# EasyEDA schematic 1-Schematic_MS20_Schmitz_REPAIR.json
TITLE: Sheet_1; REV: 1.0; Date: 2025-03-28; Sheet: 1/1; Drawn By: t.friedrich-soehner; Company: Your Company
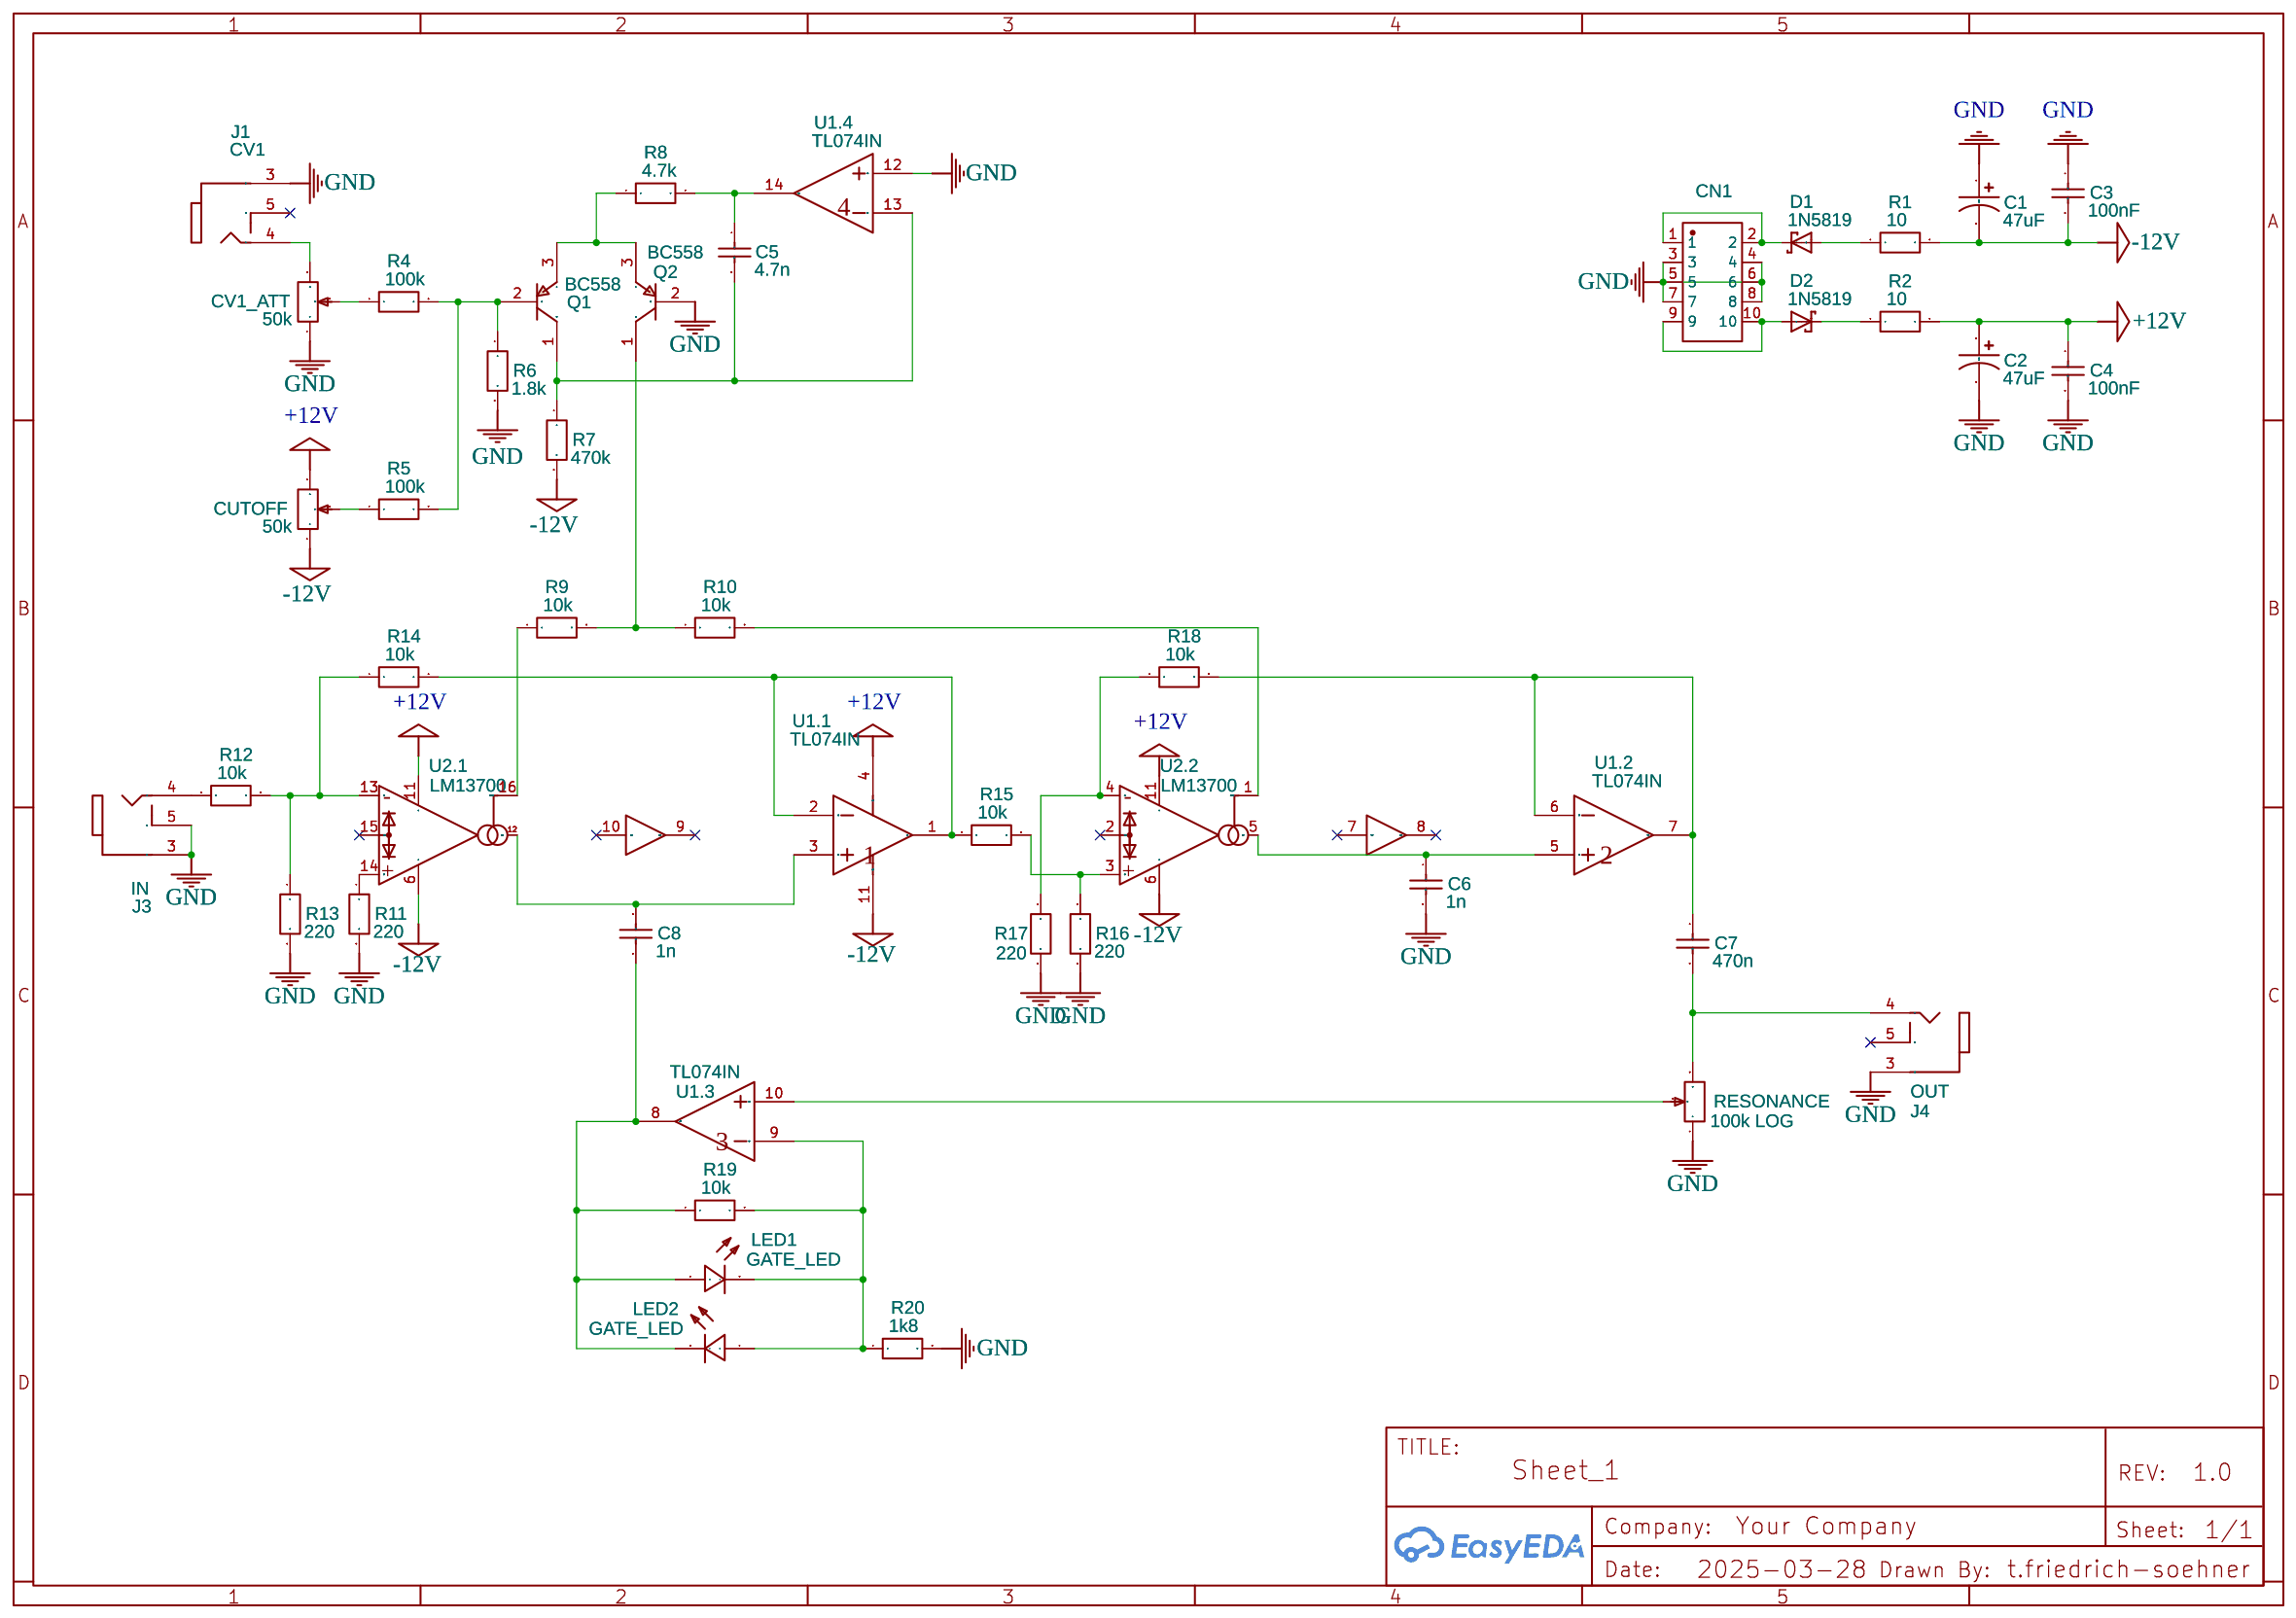
[diagram p0: schematic sheet]

## Parts
C1  47uF  [CAP-TH_BD5.0-P2.00-D0.5-FD]
C2  47uF  [CAP-TH_BD5.0-P2.00-D0.5-FD]
C3  100nF  [CAP-2.5*6.5*7.2]
C4  100nF  [CAP-2.5*6.5*7.2]
C5  4.7n  [CAP-2.5*6.5*7.2]
C6  1n  [CAP-2.5*6.5*7.2]
C7  470n  [CAP-2.5*6.5*7.2]
C8  1n  [CAP-2.5*6.5*7.2]
CN1  DC3-2.54-10PAS  [CONN-TH_10P-P2.54_DC3-2.54-10PAS]
CUTOFF  50k  [RES-ADJ-TH_RK097111080J]
CV1_ATT  50k  [RES-ADJ-TH_RK097111080J]
D1  1N5819  [DO41-7.6]
D2  1N5819  [DO41-7.6]
J1  CV1  [PJM323 TAYDA A-2557]
J3  IN  [PJM323 TAYDA A-2557]
J4  OUT  [PJM323 TAYDA A-2557]
LED1  GATE_LED  [LED-3MM/2.54]
LED2  GATE_LED  [LED-3MM/2.54]
Q1  BC558  [ONSC-TO-92-3-29-11_AM_BL]
Q2  BC558  [ONSC-TO-92-3-29-11_AM_BL]
R1  10  [RES-TH_BD2.4-L6.3-P10.30-D0.6]
R2  10  [RES-TH_BD2.4-L6.3-P10.30-D0.6]
R4  100k  [RES-TH_BD2.4-L6.3-P10.30-D0.6]
R5  100k  [RES-TH_BD2.4-L6.3-P10.30-D0.6]
R6  1.8k  [RES-TH_BD2.4-L6.3-P10.30-D0.6]
R7  470k  [RES-TH_BD2.4-L6.3-P10.30-D0.6]
R8  4.7k  [RES-TH_BD2.4-L6.3-P10.30-D0.6]
R9  10k  [RES-TH_BD2.4-L6.3-P10.30-D0.6]
R10  10k  [RES-TH_BD2.4-L6.3-P10.30-D0.6]
R11  220  [RES-TH_BD2.4-L6.3-P10.30-D0.6]
R12  10k  [RES-TH_BD2.4-L6.3-P10.30-D0.6]
R13  220  [RES-TH_BD2.4-L6.3-P10.30-D0.6]
R14  10k  [RES-TH_BD2.4-L6.3-P10.30-D0.6]
R15  10k  [RES-TH_BD2.4-L6.3-P10.30-D0.6]
R16  220  [RES-TH_BD2.4-L6.3-P10.30-D0.6]
R17  220  [RES-TH_BD2.4-L6.3-P10.30-D0.6]
R18  10k  [RES-TH_BD2.4-L6.3-P10.30-D0.6]
R19  10k  [RES-TH_BD2.4-L6.3-P10.30-D0.6]
R20  1k8  [RES-TH_BD2.4-L6.3-P10.30-D0.6]
RESONANCE  100k LOG  [RES-ADJ-TH_RK097111080J]
U1  TL074IN  [PDIP-14_L19.3-W6.4-P2.54-LS7.9-BL-1]  (sections 1,2,3,4)
U2  LM13700  [PDIP16]  (sections 1,2)

## Library data of the parts
C1 C2 = 50MS710MEFCTZ5X7: Contributor: lcsc; Supplier: LCSC; Supplier Part: C5115261; Manufacturer: rubycon(红宝石)
C3-C8 = 0.22uF 5% 100VCalibration capacitor: Supplier Part: undefined; Supplier: LCSC; Manufacturer: ReliaPro
CN1 = DC3-2.54-10PAS: Contributor: lcsc; Supplier: LCSC; Supplier Part: C2977596; Manufacturer: ZHOURI(洲日); JLCPCB Part Class: Extended Part
CUTOFF CV1_ATT RESONANCE = RK097111080J: Resistance(Ohms): 10K; Supplier: LCSC; Manufacturer: ALPSALPINE(阿尔卑斯阿尔派); Supplier Part: C97444; JLCPCB Part Class: Extended Part
D1 D2 = 1N5819-B: 1.0A SCHOTTKY BARRIER RECTIFIER
J1 J3 J4 = PJ323M Tayda: Supplier: Tayda; Supplier Part: A-2557; Contributor: flounderguts
LED1 LED2 = LED-3MM: Supplier: LCSC; Manufacturer: EVERLIGHT; Manufacturer Part: 204-10SURD/S530-A3; Supplier Part: C99772
Q1 Q2 = BC558BRLG: Amplifier Transistor, PNP Silicon, 3-Pin TO-92, Pb-Free, Tape and Reel
R1 R2 R4-R20 = Res_AXIAL-0.4(1/4W)_US
U1 = TL074IN: subpart_no: 1; Supplier: LCSC; Supplier Part: C1346811; Manufacturer: TI(德州仪器); JLCPCB Part Class: Extended Part
U2 = LM13700: Contributor: Components; subpart_no: 1

## Nets
+12V: C2.1 C4.1 CUTOFF.3 R2.2 U1.4(VCC) U2.11(V+)
-12V: C1.2 C3.2 CUTOFF.1 R1.2 R7.2 U1.11(GND) U2.6(V-)
GND: C1.1 C2.2 C3.1 C4.2 C6.2 CN1.3 CN1.4 CN1.5 CN1.6 CN1.7 CN1.8 CV1_ATT.1 J1.3 J3.3 J3.5 J4.3 Q2.2(B) R6.2 R11.2 R13.2 R16.2 R17.2 R20.2 RESONANCE.1 U1.12(IN4+)
Net-(C5-1): C5.1 R8.2 U1.14(OUT4)
Net-(C5-2): C5.2 Q1.1(C) R7.1 U1.13(IN4-)
Net-(C6-1): C6.1 U1.5(IN2+) U2.5(Output)
Net-(C7-1): C7.1 R18.2 U1.6(IN2-) U1.7(OUT2)
Net-(C7-2): C7.2 J4.4 RESONANCE.3
Net-(C8-1): C8.1 U1.3(IN1+) U2.12(Output)
Net-(C8-2): C8.2 LED1.1(+) LED2.2(-) R19.1 U1.8(OUT3)
Net-(CN1-1): CN1.1 CN1.2 D1.C
Net-(CN1-9): CN1.9 CN1.10 D2.A
Net-(CUTOFF-2): CUTOFF.2 R5.1
Net-(CV1_ATT-2): CV1_ATT.2 R4.1
Net-(CV1_ATT-3): CV1_ATT.3 J1.4
Net-(D1-A): D1.A R1.1
Net-(D2-C): D2.C R2.1
Net-(J3-4): J3.4 R12.1
Net-(LED1-2): LED1.2(-) LED2.1(+) R19.2 R20.1 U1.9(IN3-)
Net-(Q1-2): Q1.2(B) R4.2 R5.2 R6.1
Net-(Q1-3): Q1.3(E) Q2.3(E) R8.1
Net-(Q2-1): Q2.1(C) R9.2 R10.1
Net-(R9-1): R9.1 U2.16(Amplifier Bias Input)
Net-(R10-2): R10.2 U2.1(Amplifier Bias Input)
Net-(R11-1): R11.1 U2.14(INP)
Net-(R12-2): R12.2 R13.1 R14.1 U2.13(INN)
Net-(R14-2): R14.2 R15.1 U1.1(OUT1) U1.2(IN1-)
Net-(R15-2): R15.2 R16.1 U2.3(INP)
Net-(R17-1): R17.1 R18.1 U2.4(INN)
Net-(RESONANCE-2): RESONANCE.2 U1.10(IN3+)

Not connected (* = marked no-connect by the designer): J1 5*; J4 5*; U2 2(Diode Bias)* 7(Buffer_in)* 8(Buffer_out)* 9(Buffer_out)* 10(Buffer_in)* 15(Diode Bias)*
